# EAGLE design Environment-TinyPICO-Mini-Enclosure-V9 (EAGLE 7.4.0)
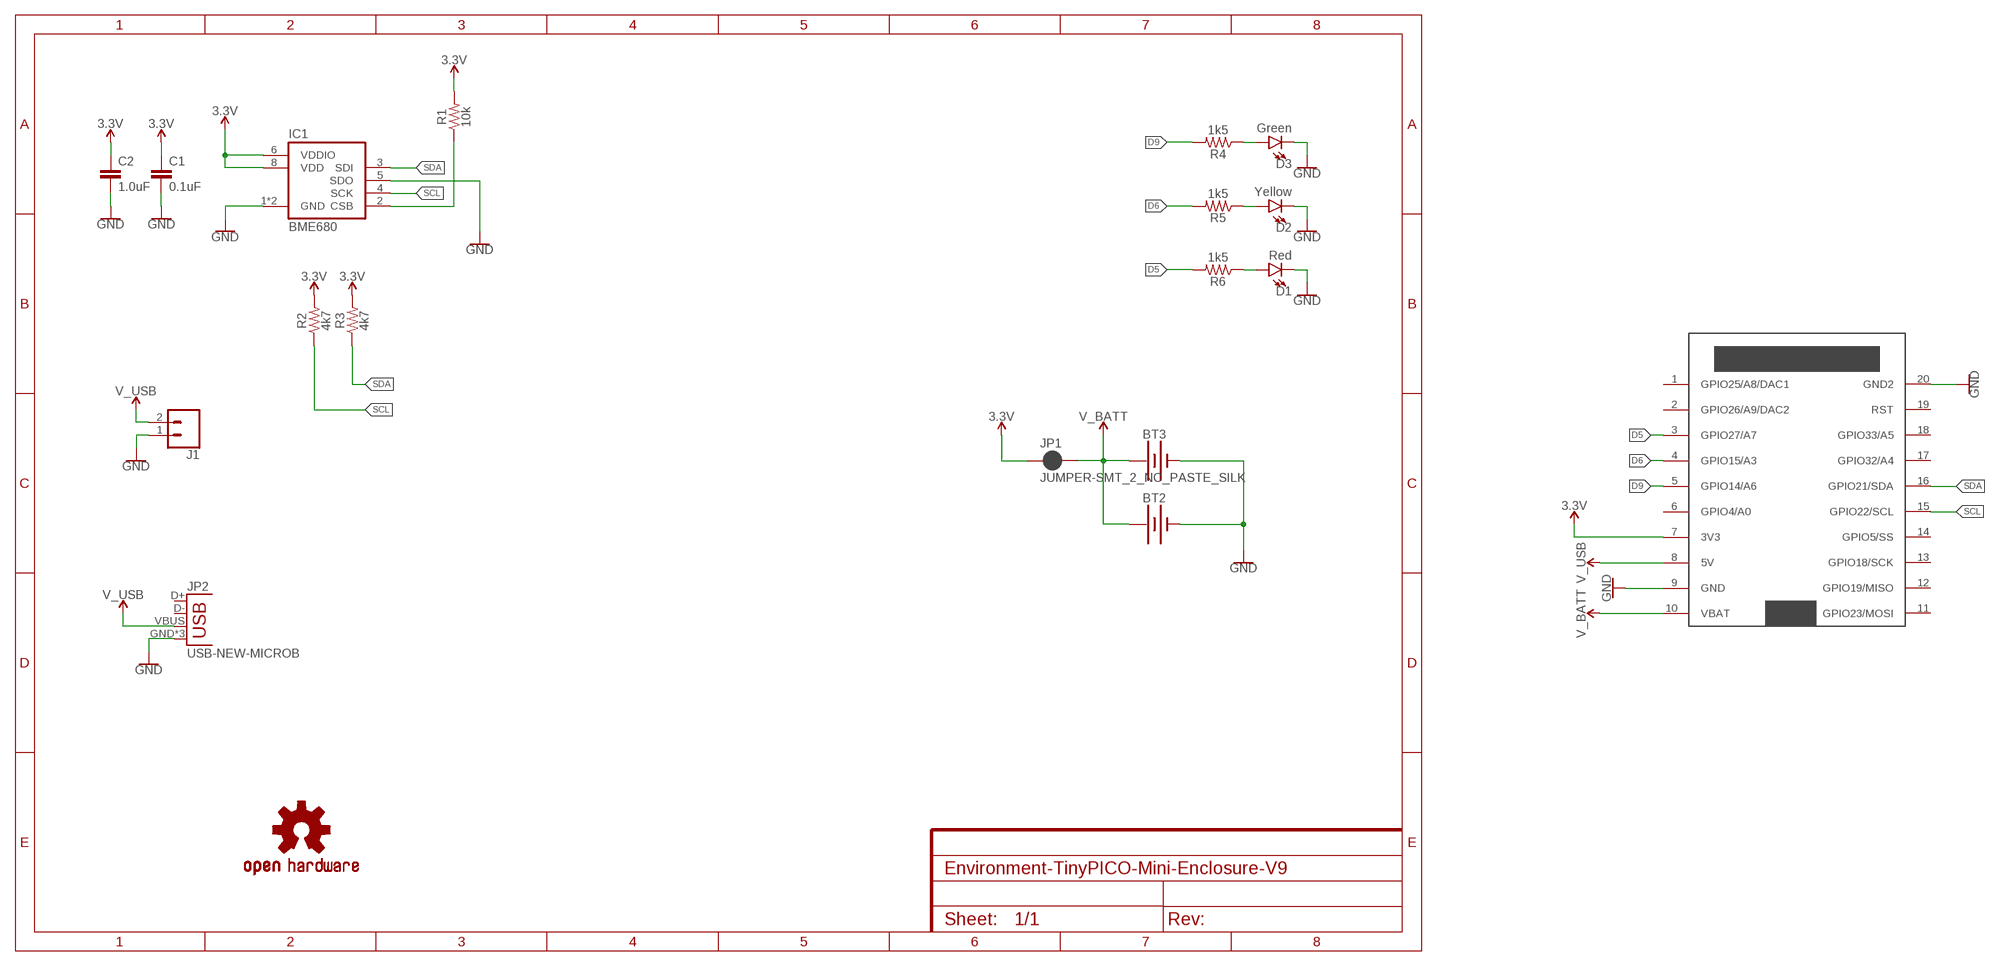
[diagram p0: schematic, sheet 1]

## Parts
BT2  BATTERY-12MM_PTH  [BATTCON_12MM_PTH]
BT3  BATTERY-12MM_PTH  [BATTCON_12MM_PTH]
C1  0.1uF  0.1UF-0805-25V  [0805]
C2  1.0uF  1.0UF-0805-25V-10%  [0805]
D1  Red  LED1206  [LED-1206]
D2  Yellow  LED1206  [LED-1206]
D3  Green  LED1206  [LED-1206]
IC1  BME680  [BME680]
J1  CONN_02JST-2-PH-SIDE  [JST-2-SMD]
JP1  JUMPER-SMT_2_NC_PASTE_SILK  [SMT-JUMPER_2_NC_PASTE_SILK]
JP2  USB-NEW-MICROB  [USB-MICROB]
LOGO1  OSHW-LOGOM  [OSHW-LOGO-M]
R1  10k  RESISTOR0805  [0805]
R2  4k7  RESISTOR0805  [0805]
R3  4k7  RESISTOR0805  [0805]
R4  1k5  RESISTOR0805  [0805]
R5  1k5  RESISTOR0805  [0805]
R6  1k5  RESISTOR0805  [0805]
U$2  TINY_PICO  [TINY_PICO]

## Nets
3.3V: C1.1 C2.1 IC1.6(VDDIO) IC1.8(VDD) JP1.1 R1.2 R2.2 R3.2 U$2.7(3V3)
D5: R6.2 U$2.3(GPIO27/A7)
D6: R5.2 U$2.4(GPIO15/A3)
D9: R4.2 U$2.5(GPIO14/A6)
GND: BT2.GND(-) BT3.GND(-) C1.2 C2.2 D1.C D2.C D3.C IC1.1(GND) IC1.5(SDO) IC1.7(GND) J1.1 JP2.GND JP2.MT1(GND) JP2.MT2(GND) U$2.9(GND) U$2.20(GND2)
N$2: IC1.2(CSB) R1.1
N$8: D3.A R4.1
N$9: D2.A R5.1
N$10: D1.A R6.1
SCL: IC1.4(SCK) R2.1 U$2.15(GPIO22/SCL)
SDA: IC1.3(SDI) R3.1 U$2.16(GPIO21/SDA)
V_BATT: BT2.VCC@1(+) BT3.VCC@1(+) JP1.2 U$2.10(VBAT)
V_USB: J1.2 JP2.VBUS U$2.8(5V)
Unconnected: JP2.D+ JP2.D- U$2.1(GPIO25/A8/DAC1) U$2.2(GPIO26/A9/DAC2) U$2.6(GPIO4/A0) U$2.11(GPIO23/MOSI) U$2.12(GPIO19/MISO) U$2.13(GPIO18/SCK) U$2.14(GPIO5/SS) U$2.17(GPIO32/A4) U$2.18(GPIO33/A5) U$2.19(RST)

## Library data of the parts
BT2 BT3 = ThingySticks:BATTERY: Battery - Single Cell A variety of battery chemistries, sizes, and footprints. Device List: 20MM_PTH - Coin Cell Battery Holder - 20mm (PTH) <https://www.sparkfun.com/products/783> 12MM_SMD - Coin Cell Battery Holder - 12mm (SMD) <https://www.sparkfun.com/products/10592> 12MM_PTH - Coin Cell Battery Holder - 12mm (PTH) <https://www.sparkfun.com/products/7948> 20MM_SMD - 20mm Coin Cell Battery Holder (SMD) (2 legs) Used on the Big Time Watch Kit <https://www.sparkfun.com/products/11734> 20MM_SMD_4LEGS - Coin Cell Battery Holder - 20mm (SMD) <https://www.sparkfun.com/products/11892> 20MM_SMD_4LEGS_OVERPASTE - Coin Cell Battery Holder - 20mm (SMD) <https://www.sparkfun.com/products/11892> (Over-paste on the legs) 24.5MM_PTH - Coin Cell Battery Holder - 24.5mm (PTH) <https://www.sparkfun.com/products/8863> 9V - 9V Battery Holder - PC Mount Used on the SparkFun SparkPunk Sound Kit <https://www.sparkfun.com/products/11177> and SparkFun SparkPunk Sequencer Kit <https://www.sparkfun.com/products/12707> 18650 - Battery Holder - 18650 (PTH) <https://www.sparkfun.com/products/13113> AA - Battery Holder - 1xAA (PTH) <https://www.sparkfun.com/products/7949> AAA - Battery Holder - 1xAAA (PTH) <https://www.sparkfun.com/products/12718> AA_KIT - Battery Holder - 1xAA (PTH) <https://www.sparkfun.com/products/7949> Special kit package - pads only have exposed copper on one side of the board. AAA_KIT - Battery Holder - 1xAAA (PTH) <https://www.sparkfun.com/products/12718> Special kit package - pads only have exposed copper on one side of the board.; PROD_ID: BATT-08315; SF_SKU: PRT-07948
C1 = ThingySticks:0.1UF: 0.1µF ceramic capacitors A capacitor is a passive two-terminal electrical component used to store electrical energy temporarily in an electric field.
C2 = ThingySticks:1.0UF: 1µF ceramic capacitors A capacitor is a passive two-terminal electrical component used to store electrical energy temporarily in an electric field.
D1-D3 = ThingySticks:LED: LED (Generic) Standard schematic elements and footprints for 5mm, 3mm, 1206, and 0603 sized LEDs. Generic LEDs with no color specified.
IC1 = ThingySticks:BME680: BME680 integrates for the first time individual high linearity and high accuracy sensors for gas, pressure, humidity and temperature. The library has been designed by Richard Magdycz <https://www.facebook.com/groups/eaglecadsoftUK> Original version had pins in incorrect places (BME680 uses untypical clockwise direction). Updated 17 Feb 2018 S.Harrison ThingySticks.com
J1 = ThingySticks:CONN_02: Multi connection point. Often used as Generic Header-pin footprint for 0.1 inch spaced/style header connections On any of the 0.1 inch spaced packages, you can populate with these: Break Away Headers - Straight <https://www.sparkfun.com/products/116> (PRT-00116) Break Away Male Headers - Right Angle <https://www.sparkfun.com/products/553> (PRT-00553) Female Headers <https://www.sparkfun.com/products/115> (PRT-00115) Break Away Headers - Machine Pin <https://www.sparkfun.com/products/117> (PRT-00117) Break Away Female Headers - Swiss Machine Pin <https://www.sparkfun.com/products/743> (PRT-00743) For SCREWTERMINALS and SPRING TERMINALS visit here: Screw Terimnals on SparkFun.com <https://www.sparkfun.com/search/results?term=Screw+Terminals> (5mm/3.5mm/2.54mm spacing) This device is also useful as a general connection point to wire up your design to another part of your project. Our various solder wires solder well into these plated through hole pads. Hook-Up Wire - Assortment (Stranded, 22 AWG) <https://www.sparkfun.com/products/11375> (PRT-11375) Hook-Up Wire - Assortment (Solid Core, 22 AWG) <https://www.sparkfun.com/products/11367> (PRT-11367) View the entire wire category on our website here <https://www.sparkfun.com/categories/141> Special notes: Molex polarized connector foot print use with: PRT-08233 with associated crimp pins and housings. 2.54_SCREWTERM for use with PRT-10571. 3.5mm Screw Terminal footprints for PRT-08084 5mm Screw Terminal footprints for use with PRT-08432
JP1 = SparkFun-Jumpers:JUMPER-SMT_2_NC_PASTE: Normally closed solder jumper This jumper has an aperture in the stencil to allow solder paste to bridge the split in the wire so it's normally closed (NC). Wick off the solder to open the connection. Reapply solder to reclose the connection.
JP2 = Tinamous:USB-NEW: USB Connectors USB-B-PTH is fully proven SKU : PRT-00139/CONN-08278 USB-miniB is fully proven SKU : PRT-00587 USB-A-PCB is untested. USB-A-H is throughly reviewed, but untested. Spark Fun Electronics SKU : PRT-00437 USB-B-SMT is throughly reviewed, but untested. Needs silkscreen touching up. USB-A-S has not been used/tested USB-MB-H has not been used/tested USB-MICROB has been used. CONN-09505; PROD_ID: CONN-09505
LOGO1 = SparkFun-Aesthetics:OSHW-LOGO: Open-Source Hardware (OSHW) Logo This logo indicates the piece of hardware it is found on incorporates a OSHW license and/or adheres to the definition of open source hardware found here: http://freedomdefined.org/OSHW
R1-R6 = SparkFun-Resistors:RESISTOR: Generic Resistor Package
U$2 = ThingySticks:TINY_PICO

## Board
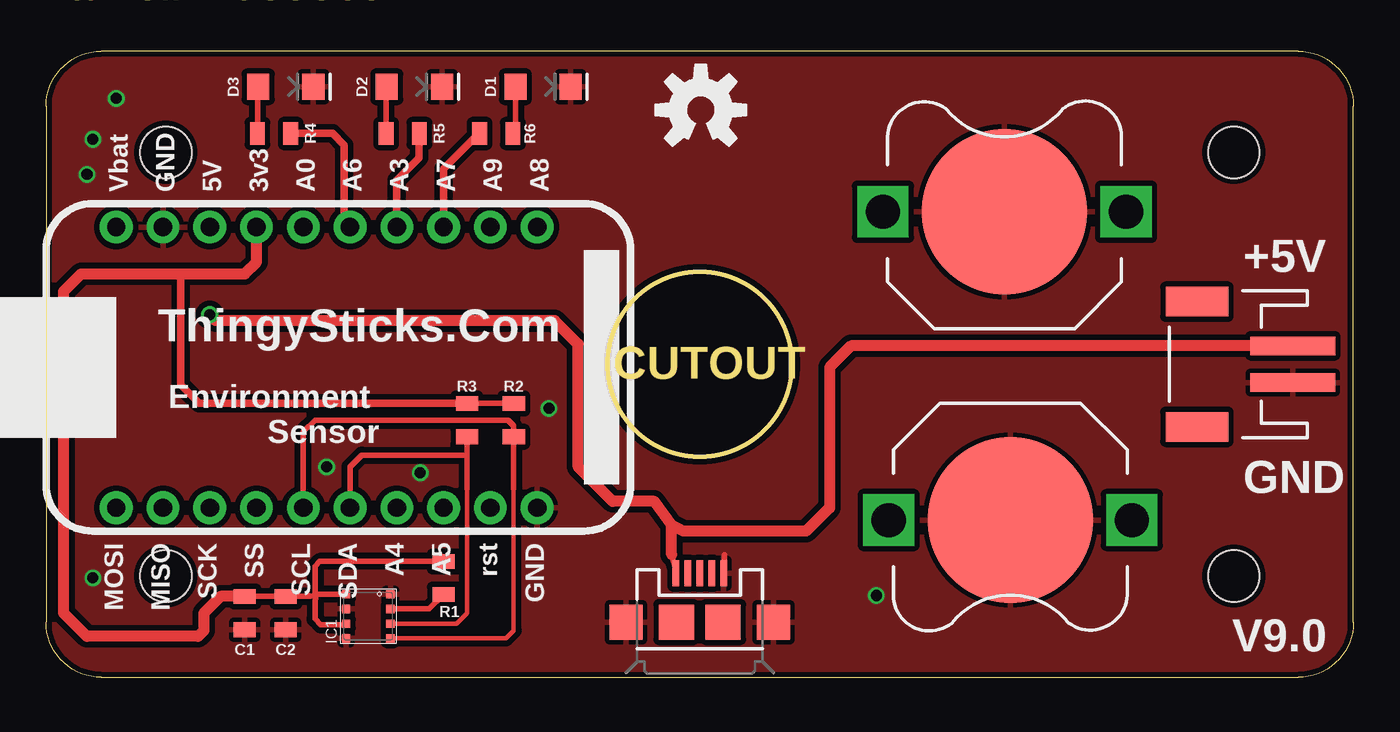
[diagram p1: board, top side]
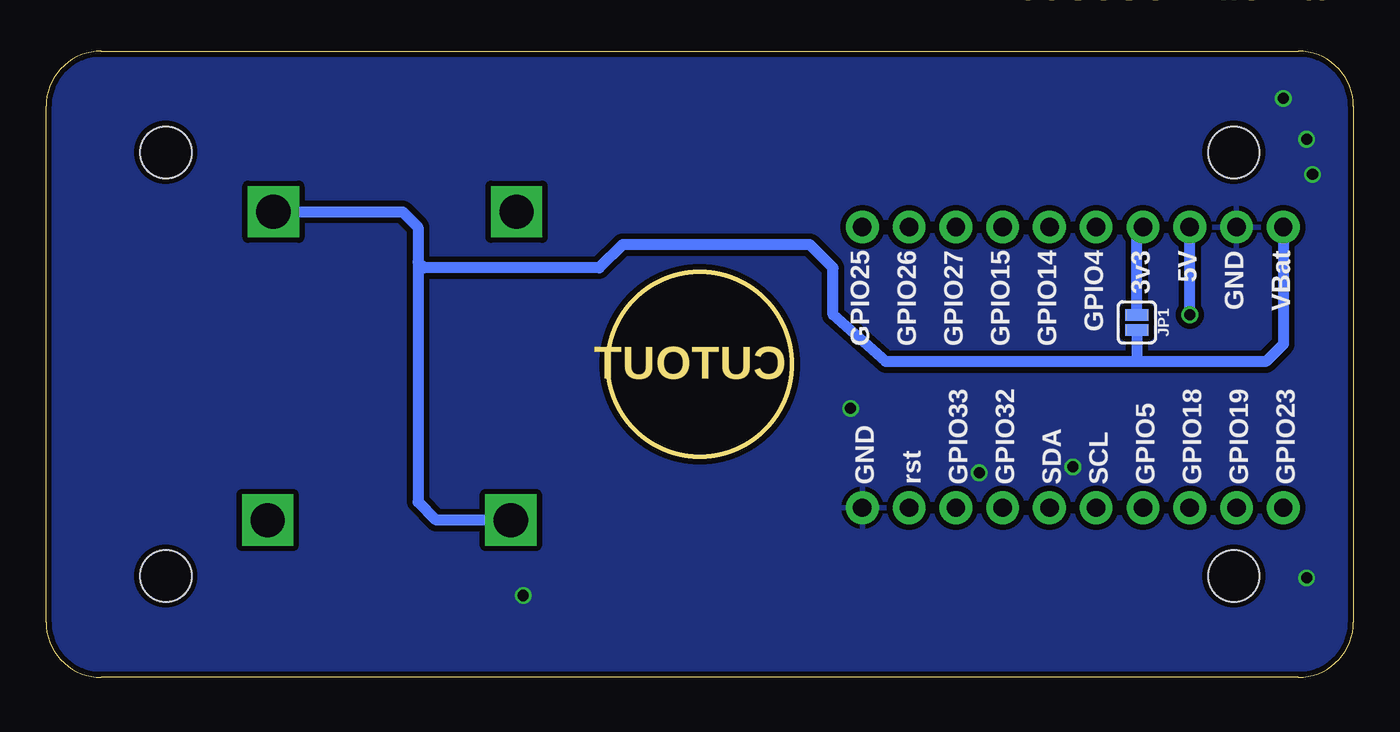
[diagram p2: board, bottom side, seen from below]

Size 71 x 34 mm. Coordinates in mm from the lower left corner, seen from the top.
Outline: 3,0 68,0 arc90 71,3 71,31 arc90 68,34 3,34 arc90 0,31 0,3 arc90 3,0
Outline: circle at 35.5,17 radius 5
Copper layers (1*16): Top 0.035mm / dielectric 1.5mm / Bottom 0.035mm
Design rules "dirt_cheap_dirty_boards.v1.1": minimum track width 6mil, minimum drill 12mil, track to track 6mil, track to pad 6mil, pad to pad 6mil, via to via 6mil, smd to smd 0mil, copper to edge 10mil, drill to drill 10mil, minimum pad ring 10mil, minimum via ring 6mil, stop-mask expansion 2mil, vias tented up to drill 25mil, thermal gap 10mil
Holes 2.8 mm at 64.5,28.5 6.5,28.5 6.5,5.5 64.5,5.5
tKeepout: area 4.5,26.5 to 8.5,30.5; area 4.3,3.3 to 8.7,7.7; area 62.3,3.3 to 66.7,7.7; area 62.3,26.3 to 66.7,30.7
bKeepout: area 62.5,26.5 to 66.5,30.5; area 62.5,3.5 to 66.5,7.5; area 4.3,26.3 to 8.7,30.7; area 4.5,3.5 to 8.5,7.5

### Footprints (pad centres in the part's own frame; a part is rotated, then mirrored left to right if it is on the bottom)
BATTCON_12MM_PTH = smd 9 x 9: GND 0,0 | drill 1.854 square: VCC@1 6.604,0; VCC@2 -6.604,0
0805 = smd 0.8 x 1.2: 1 -0.9,0; 2 0.9,0
LED-1206 = smd 1.2 x 1.4: A -1.5,0; C 1.5,0
BME680 = smd 0.45 x 0.45: 1 1.2,-1.2; 2 0.4,-1.2; 3 -0.4,-1.2; 4 -1.2,-1.2; 5 -1.2,1.2; 6 -0.4,1.2; 7 0.4,1.2; 8 1.2,1.2
JST-2-SMD = smd 1 x 4.6: 1 -1,-3.7; 2 1,-3.7 | smd 1.6 x 3.4: NC1 -3.4,1.5; NC2 3.4,1.5
SMT-JUMPER_2_NC_PASTE_SILK = smd 0.635 x 1.27: 1 -0.406,0; 2 0.406,0
USB-MICROB = smd 0.35 x 1.4: D+ 0,2.65; D- -0.65,2.65; GND 1.3,2.65; ID 0.65,2.65; VBUS -1.3,2.65 | smd 1.8 x 1.9: MT1 -4,0; MT2 4,0 | smd 1.9 x 1.9: P$1 -1.27,0; P$2 1.27,0
TINY_PICO = drill 1 pad 1.778: 1 1.27,26.67; 2 1.27,24.13; 3 1.27,21.59; 4 1.27,19.05; 5 1.27,16.51; 6 1.27,13.97; 7 1.27,11.43; 8 1.27,8.89; 9 1.27,6.35; 10 1.27,3.81; 11 16.51,3.81; 12 16.51,6.35; 13 16.51,8.89; 14 16.51,11.43; 15 16.51,13.97; 16 16.51,16.51; 17 16.51,19.05; 18 16.51,21.59; 19 16.51,24.13; 20 16.51,26.67

### Placement (x,y rotation side)
BT2  52.37,8.54 180 top
BT3  52.05,25.28 0 top
C1  10.79,3.49 270 top
C2  13.02,3.49 270 top
D1  26.99,32.07 0 top
D2  20,32.07 0 top
D3  13.02,32.07 0 top
IC1  17.5,3.32 90 top
J1  64,17 90 top
JP1  11.77,19.27 270 bottom
JP2  35.5,3 0 top
LOGO1  35.56,30.8 0 top
R1  21.59,5.4 90 top
R2  25.4,13.97 90 top
R3  22.86,13.97 90 top
R4  12.38,29.53 0 top
R5  19.37,29.53 0 top
R6  24.45,29.53 180 top
U$2  0,25.72 270 top

### Tracks (layer width: path | path; a pad name or v marks a point on that pad's centre or on a via)
3.3V
  Top 0.305: 14.68,4.52 14.85,4.52 | 14.34,4.39 14.29,4.45 | C1.1 C2.1 14.34,4.39 | 14.34,4.39 14.85,4.52 | IC1.8 14.85,4.52 | 14.68,4.52 14.61,4.13 14.61,3.17 14.92,2.86 16.24,2.86 IC1.6 | R2.2 R3.2 | R1.2 14.87,6.3 14.61,6.03 14.61,4.59 14.68,4.52
  Top 0.406: R3.2 8.31,14.87 7.3,15.88 7.3,21.91
  Top 0.61: C1.1 9.47,4.39 8.57,3.49 8.57,2.54 8.26,2.22 2.22,2.22 0.95,3.49 0.95,20.95 1.91,21.91 7.3,21.91 10.79,21.91 11.43,22.54 U$2.7
  Bottom 0.61: JP1.1 11.77,24.11 U$2.7
D5
  Top 0.305: R6.2 23.5,29.53 23.18,29.21 22.86,28.89
  Top 0.406: U$2.3 21.59,27.62 23.18,29.21
D6
  Top 0.406: R5.2 20.27,28.2 19.05,26.99 U$2.4
D9
  Top 0.406: R4.2 15.56,29.53 16.19,28.89 16.19,24.77 U$2.5
GND  (via drill 0.6)
  Top 0.305: 36.83,6.67 36.83,5.68 JP2.GND
  other vias: 27.3,14.61 2.22,27.3 2.54,5.4 2.54,29.21 3.81,31.43 15.24,11.43 45.09,4.45 20.32,11.11
  pour Bottom (isolate 0.305, rank 6): 0,33.97 71.12,33.97 71.12,0 0,0
  pour Top (isolate 0.305, rank 6): 0,33.97 71.12,33.97 71.12,0 0,0
N$2
  Top 0.305: IC1.2 20.81,3.72 R1.1
N$8
  Top 0.305: R4.1 11.48,32.03 D3.A
N$9
  Top 0.305: R5.1 18.47,32.03 D2.A
N$10
  Top 0.305: D1.A 25.49,29.67 R6.1
SCL
  Top 0.254: IC1.4 24.98,2.12 25.4,2.54 25.4,10.23
  Top 0.305: 25.4,10.23 R2.1 25.4,13.65 25.08,13.97 14.61,13.97 13.97,13.34 U$2.15
SDA
  Top 0.254: IC1.3 22.29,2.92 22.86,3.49 22.86,10.23
  Top 0.305: R3.1 22.86,12.06 | 22.86,12.06 22.86,10.23 | U$2.16 16.51,11.43 17.14,12.06 22.86,12.06
V_BATT
  Bottom 0.61: BT3.VCC@1 51.63,25.28 50.8,24.45 50.8,22.54 | 50.8,22.54 50.8,9.53 49.81,8.54 BT2.VCC@1 | 11.75,17.14 4.76,17.14 3.81,18.1 U$2.10 | 11.75,17.14 25.4,17.14 28.26,19.68 28.26,22.23 29.53,23.5 39.69,23.5 40.96,22.23 50.48,22.23 50.8,22.54 | JP1.2 11.77,17.16 11.75,17.14
V_USB  (via drill 0.6)
  Top 0.305: JP2.VBUS 34.2,5.8 33.97,6.67
  Top 0.61: 33.97,6.67 33.97,8.26 | J1.2 43.72,18 42.55,16.83 42.55,9.21 41.27,7.94 34.61,7.94 33.97,8.26 | 33.97,8.26 33.02,9.55 30.77,9.55 28.89,11.43 28.89,18.1 27.62,19.37 9.21,19.37 v8.89,19.68
  Bottom 0.61: v8.89,19.68 U$2.8

### Text on the board
Dimension: For Enclosure: / Hammon - 1551V2WH - / Plastic Enclosure, Small, ABS, 80 mm, 40 mm, 20 mm, IP30 / / Farnell: 2985869 | CUTOUT
tNames: +5V | ThingySticks.Com | Environment / Sensor | GND | V9.0